# EAGLE schematic GBA_Template (EAGLE 6.6.0)
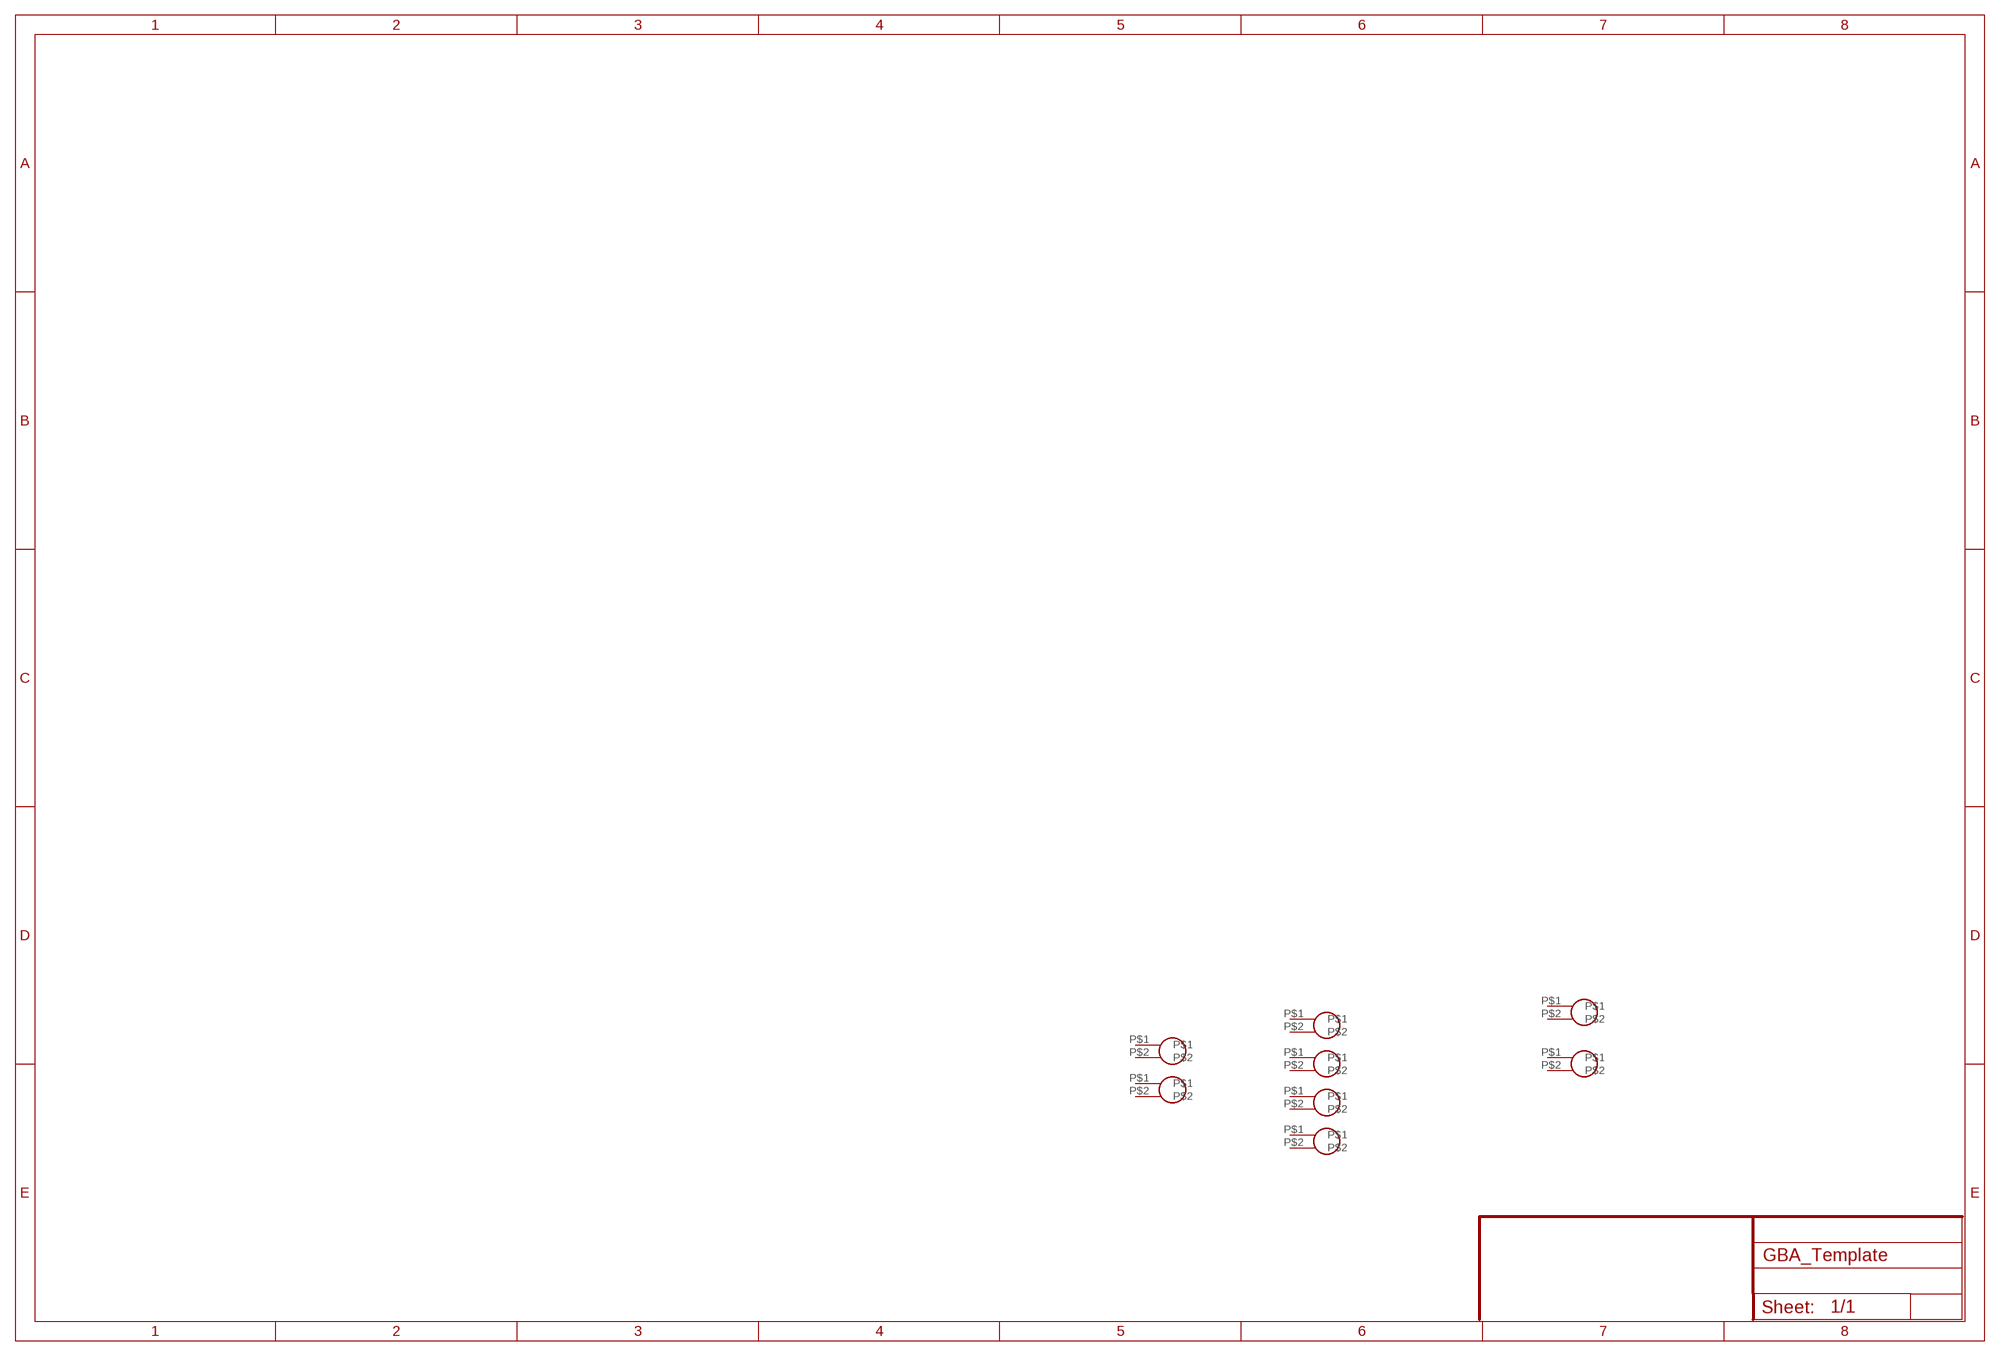
[diagram p0: schematic, sheet 1]

## Parts
U$4  GBA_BUTTONAB  [GBA_AB]
U$5  GBA_BUTTONAB  [GBA_AB]
U$6  GBA_BUTTONDIREKTION  [GBA_DIREKTION]
U$7  GBA_BUTTONDIREKTION  [GBA_DIREKTION]
U$8  GBA_BUTTONDIREKTION  [GBA_DIREKTION]
U$9  GBA_BUTTONDIREKTION  [GBA_DIREKTION]
U$10  GBA_BUTTONSTART  [GBA_START]
U$11  GBA_BUTTONSTART  [GBA_START]
Unconnected: U$4.P$1 U$4.P$2 U$5.P$1 U$5.P$2 U$6.P$1 U$6.P$2 U$7.P$1 U$7.P$2 U$8.P$1 U$8.P$2 U$9.P$1 U$9.P$2 U$10.P$1 U$10.P$2 U$11.P$1 U$11.P$2

## Library data of the parts
U$4-U$11 = debauer_button:GBA_BUTTON

## Net classes
0 default: width 0.203 mm, drill 0.203 mm, clearance 0.178 mm
2 gnd: width 0.254 mm, drill 0.254 mm, clearance 0.178 mm
3 usbvcc: width 0.203 mm, drill 0.406 mm, clearance 0.178 mm
4 USBpair: width 0.254 mm, drill 0.406 mm, clearance 0.508 mm